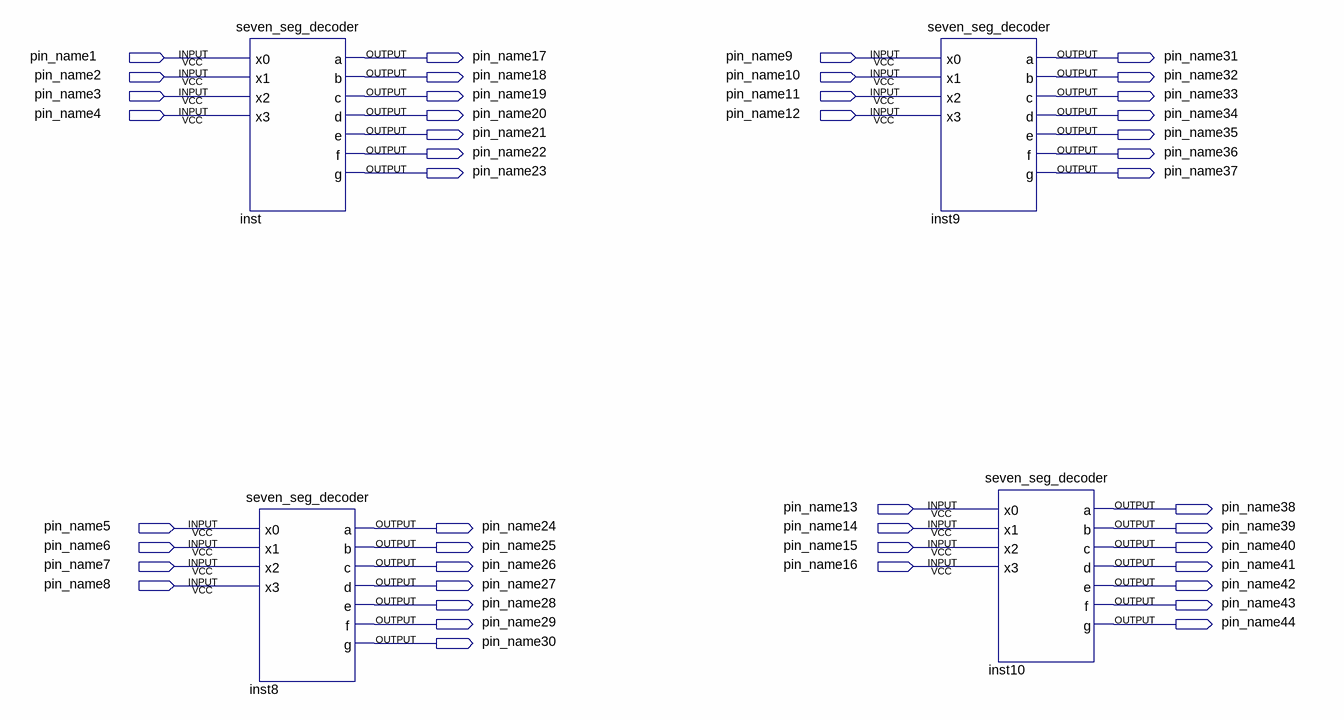
[diagram p0: schematic sheet]
// Quartus schematic lab05step1.bdf as structural Verilog: 4 symbols, 44 pins
module lab05step1 (
  input  pin_name1,
  input  pin_name9,
  input  pin_name2,
  input  pin_name10,
  input  pin_name3,
  input  pin_name11,
  input  pin_name4,
  input  pin_name12,
  input  pin_name13,
  input  pin_name5,
  input  pin_name14,
  input  pin_name6,
  input  pin_name15,
  input  pin_name7,
  input  pin_name16,
  input  pin_name8,
  output pin_name17,
  output pin_name31,
  output pin_name18,
  output pin_name32,
  output pin_name19,
  output pin_name33,
  output pin_name20,
  output pin_name34,
  output pin_name21,
  output pin_name35,
  output pin_name22,
  output pin_name36,
  output pin_name23,
  output pin_name37,
  output pin_name38,
  output pin_name24,
  output pin_name39,
  output pin_name25,
  output pin_name40,
  output pin_name26,
  output pin_name41,
  output pin_name27,
  output pin_name42,
  output pin_name28,
  output pin_name43,
  output pin_name29,
  output pin_name44,
  output pin_name30
);

  seven_seg_decoder inst (
    .x0(pin_name1), .x1(pin_name2), .x2(pin_name3), .x3(pin_name4), .a(pin_name17), .b(pin_name18),
    .c(pin_name19), .d(pin_name20), .e(pin_name21), .f(pin_name22), .g(pin_name23));
  seven_seg_decoder inst8 (
    .x0(pin_name5), .x1(pin_name6), .x2(pin_name7), .x3(pin_name8), .a(pin_name24), .b(pin_name25),
    .c(pin_name26), .d(pin_name27), .e(pin_name28), .f(pin_name29), .g(pin_name30));
  seven_seg_decoder inst9 (
    .x0(pin_name9), .x1(pin_name10), .x2(pin_name11), .x3(pin_name12), .a(pin_name31), .b(pin_name32),
    .c(pin_name33), .d(pin_name34), .e(pin_name35), .f(pin_name36), .g(pin_name37));
  seven_seg_decoder inst10 (
    .x0(pin_name13), .x1(pin_name14), .x2(pin_name15), .x3(pin_name16), .a(pin_name38), .b(pin_name39),
    .c(pin_name40), .d(pin_name41), .e(pin_name42), .f(pin_name43), .g(pin_name44));
endmodule
